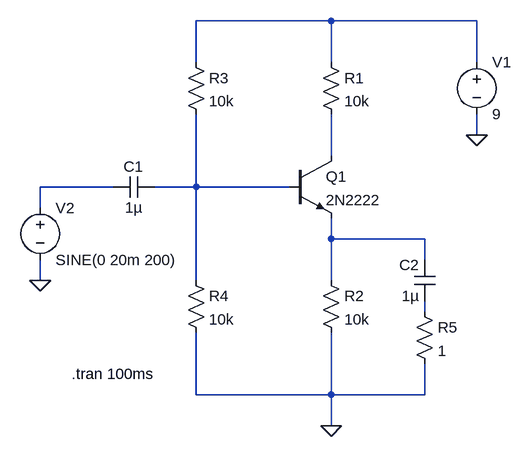
[diagram p0: schematic common-emitter-amplifier.asc]
common-emitter-amplifier.asc, the LTspice schematic file:
Version 4
SHEET 1 880 680
WIRE 304 -80 96 -80
WIRE 528 -80 304 -80
WIRE 96 -16 96 -80
WIRE 304 -16 304 -80
WIRE 528 -16 528 -80
WIRE 528 96 528 64
WIRE 304 128 304 64
WIRE -32 176 -144 176
WIRE 96 176 96 64
WIRE 96 176 32 176
WIRE 240 176 96 176
WIRE -144 208 -144 176
WIRE 304 256 304 224
WIRE 448 256 304 256
WIRE 448 288 448 256
WIRE -144 320 -144 288
WIRE 96 320 96 176
WIRE 304 320 304 256
WIRE 448 368 448 352
WIRE 96 496 96 400
WIRE 304 496 304 400
WIRE 304 496 96 496
WIRE 448 496 448 448
WIRE 448 496 304 496
WIRE 304 544 304 496
FLAG 304 544 0
FLAG 528 96 0
FLAG -144 320 0
SYMBOL npn 240 128 R0
SYMATTR InstName Q1
SYMATTR Value 2N2222
SYMBOL res 288 -32 R0
SYMATTR InstName R1
SYMATTR Value 10k
SYMBOL res 288 304 R0
SYMATTR InstName R2
SYMATTR Value 10k
SYMBOL res 80 -32 R0
SYMATTR InstName R3
SYMATTR Value 10k
SYMBOL res 80 304 R0
SYMATTR InstName R4
SYMATTR Value 10k
SYMBOL cap 32 160 R90
WINDOW 0 0 32 VBottom 2
WINDOW 3 32 32 VTop 2
SYMATTR InstName C1
SYMATTR Value 1µ
SYMBOL cap 464 352 R180
WINDOW 0 24 56 Left 2
WINDOW 3 24 8 Left 2
SYMATTR InstName C2
SYMATTR Value 1µ
SYMBOL res 432 352 R0
SYMATTR InstName R5
SYMATTR Value 1
SYMBOL voltage 528 -32 R0
WINDOW 123 0 0 Left 2
WINDOW 39 0 0 Left 2
SYMATTR InstName V1
SYMATTR Value 9
SYMBOL voltage -144 192 R0
WINDOW 123 0 0 Left 2
WINDOW 39 0 0 Left 2
SYMATTR InstName V2
SYMATTR Value SINE(0 20m 200)
TEXT -96 464 Left 2 !.tran 100ms

The netlist it stands for:
* common-emitter-amplifier.asc
Q1 N002 N004 N005 0 2N2222
R1 N001 N002 10k
R2 N005 0 10k
R3 N001 N004 10k
R4 N004 0 10k
C1 N004 N003 1µ
C2 N006 N005 1µ
R5 N006 0 1
V1 N001 0 9
V2 N003 0 SINE(0 20m 200)
.model NPN NPN
.model PNP PNP
.lib standard.bjt
.tran 100ms
.backanno
.end